# Altium schematic sheet DDS_Modul_Multiplier.SchDoc
size A4; SheetNumber: 6; SheetTotal: 7
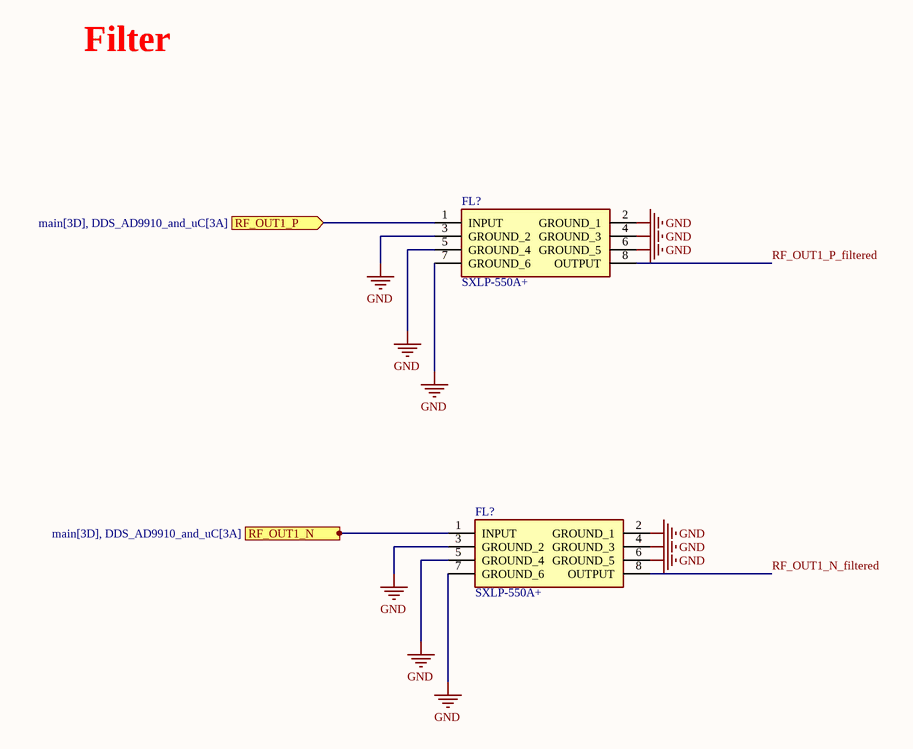
[diagram p0: DDS_Modul_Multiplier.SchDoc]

## Parts
(Parts that share a designator on the sheet are numbered #1, #2 ... from top to bottom, then left to right.)
FL?#1  SXLP-550A+  [SXLP550A]
FL?#2  SXLP-550A+  [SXLP550A]

## Ports
RF_OUT1_N (in, see main[3D], DDS_AD9910_and_uC[3A]), RF_OUT1_P (in, see main[3D], DDS_AD9910_and_uC[3A])

## Nets
GND: FL?#1.2(GROUND_1) FL?#1.3(GROUND_2) FL?#1.4(GROUND_3) FL?#1.5(GROUND_4) FL?#1.6(GROUND_5) FL?#1.7(GROUND_6) FL?#2.2(GROUND_1) FL?#2.3(GROUND_2) FL?#2.4(GROUND_3) FL?#2.5(GROUND_4) FL?#2.6(GROUND_5) FL?#2.7(GROUND_6)
RF_OUT1_N: FL?#2.1(INPUT) ; port RF_OUT1_N
RF_OUT1_N_filtered: FL?#2.8(OUTPUT)
RF_OUT1_P: FL?#1.1(INPUT) ; port RF_OUT1_P
RF_OUT1_P_filtered: FL?#1.8(OUTPUT)

## Notes on the sheet
- Filter

## Library data of the parts
FL?#1 FL?#2 = SXLP-550A+: Filter; Manufacturer_Name: Mini-Circuits; Datasheet Link: https://www.minicircuits.com/pdfs/SXLP-550A+.pdf; Height: 6.86mm; Manufacturer_Part_Number: SXLP-550A+